# EasyEDA Pro project OSC1.eprj, schematic CH1/2

## Sheets
1 CH1: Create Date: 2024-10-10; Page Name: CH1; Project Name: OSC1; Schematic Name: CH1/2; Update Date: 2024-10-12; Company: 嘉立创EDA; Page Size: A4; Version: V1.0
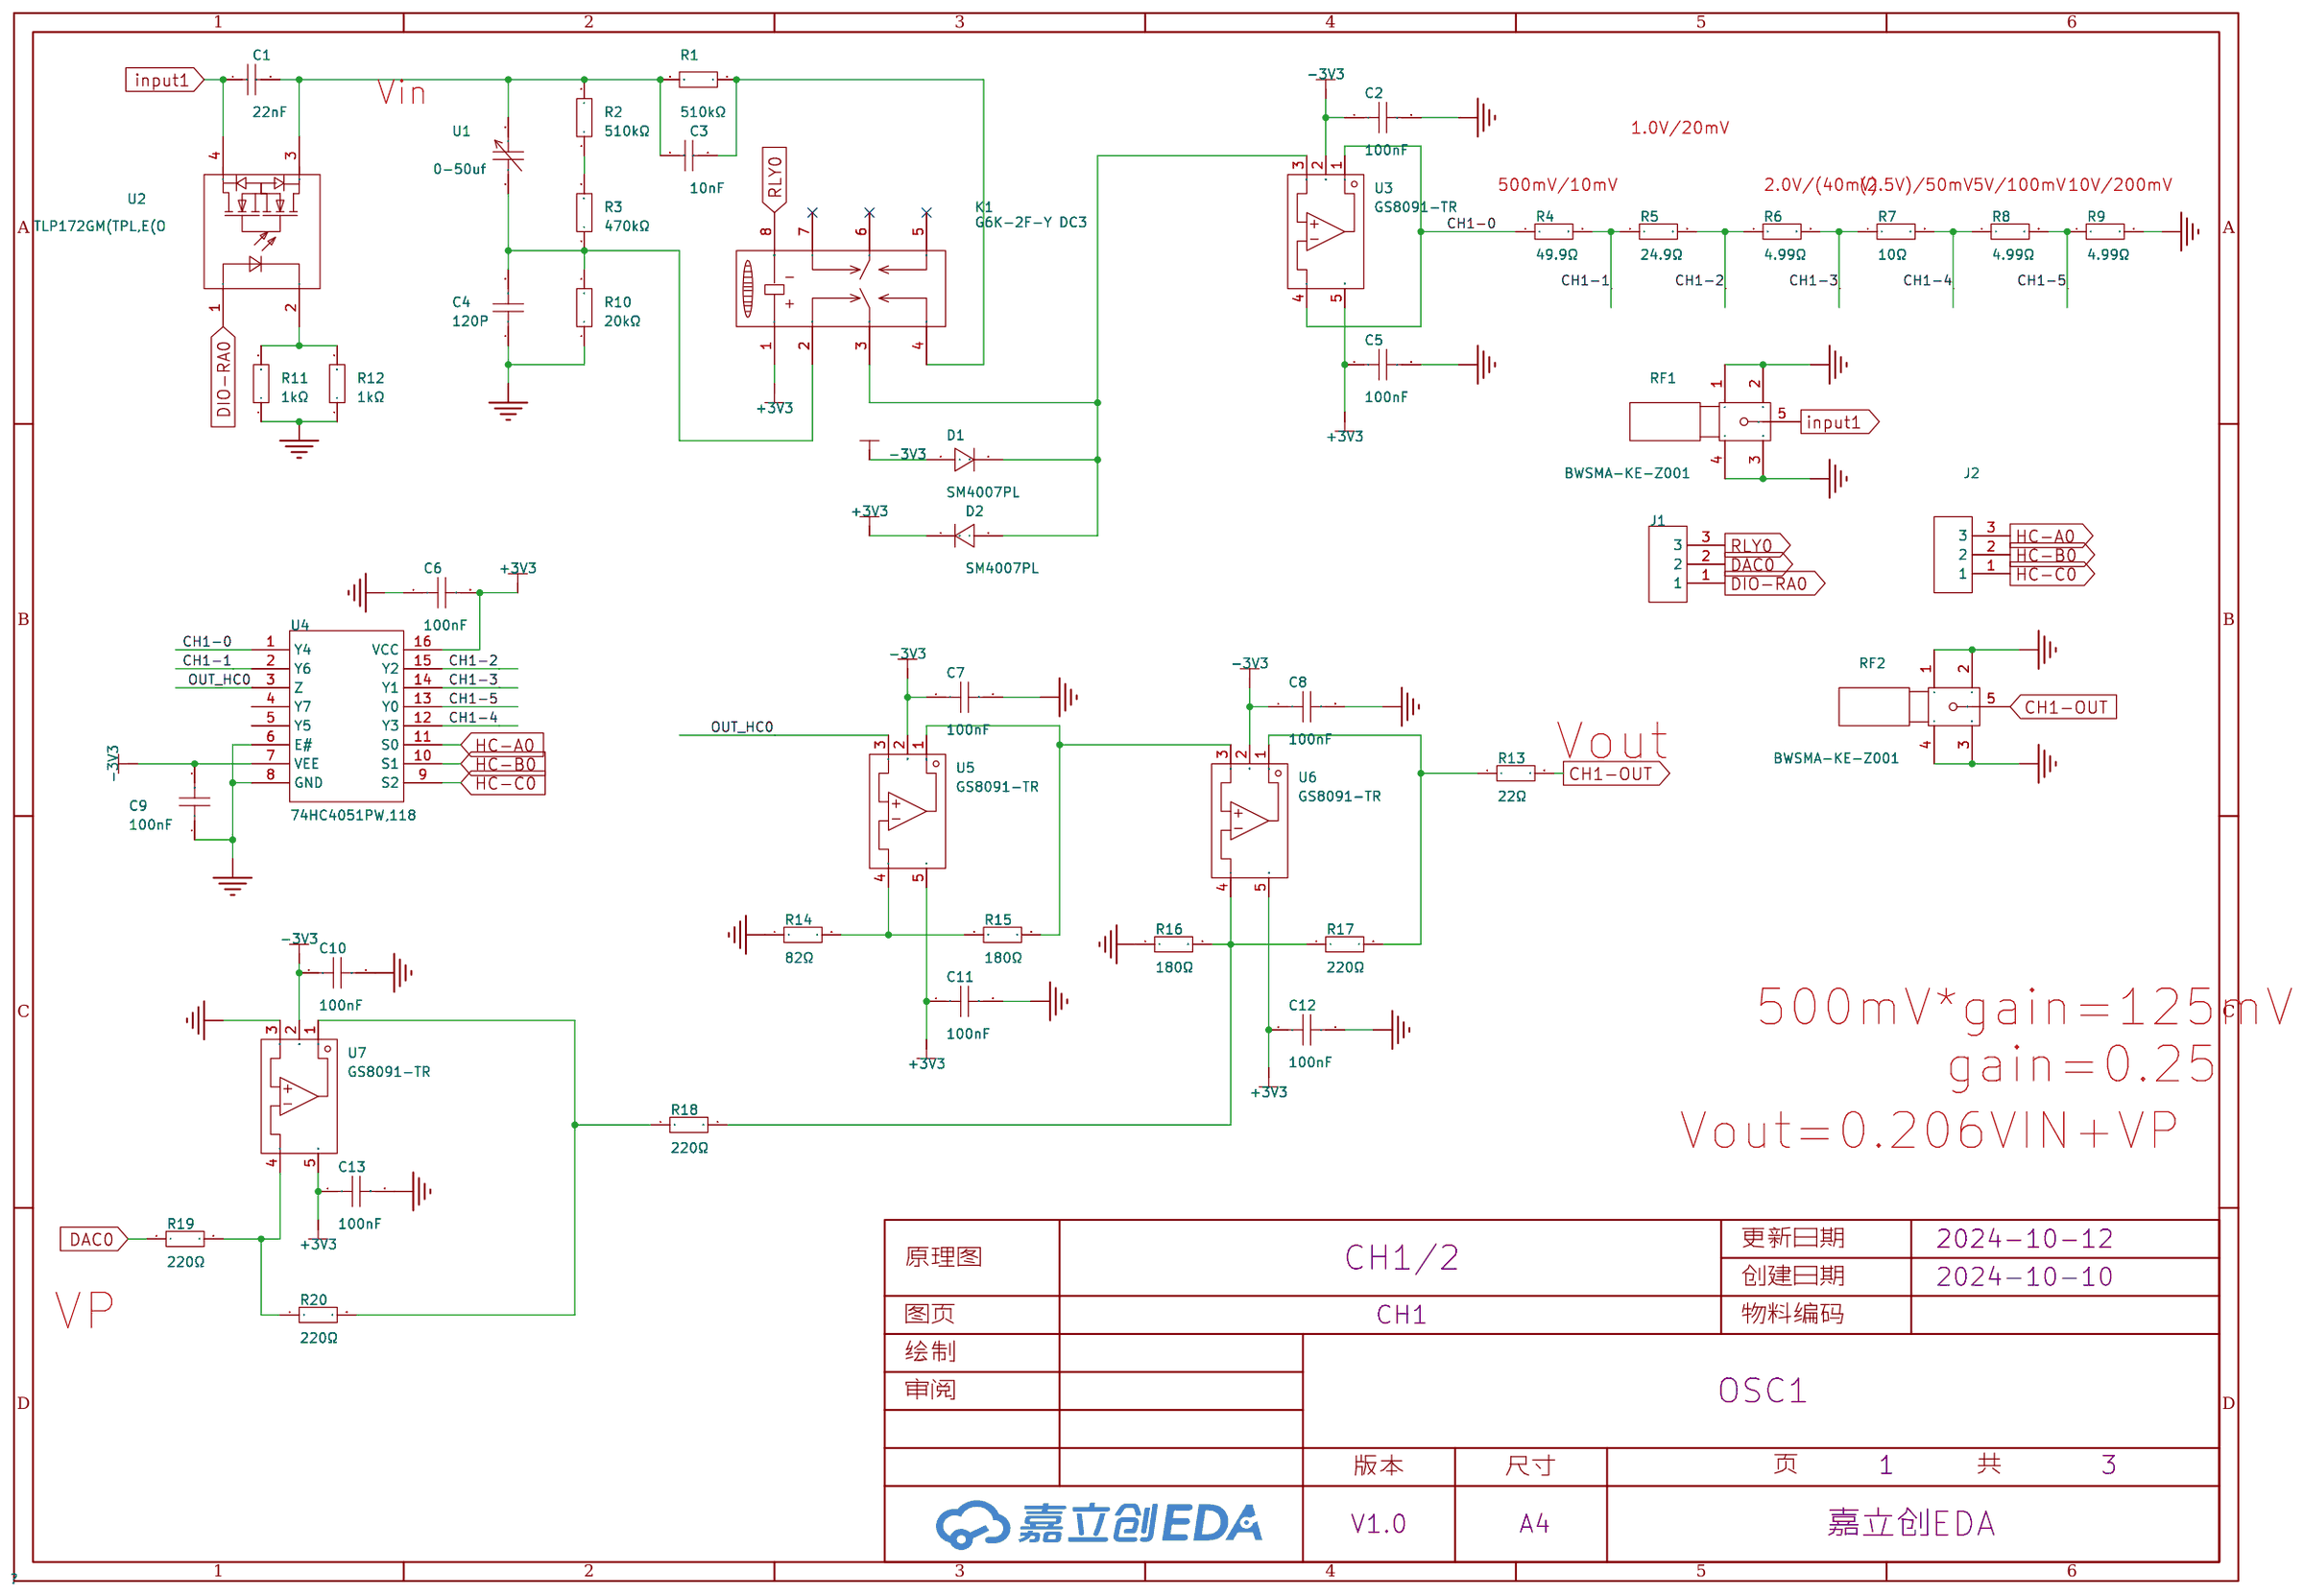
[diagram p1: CH1]
2 CH2: Page Name: CH2
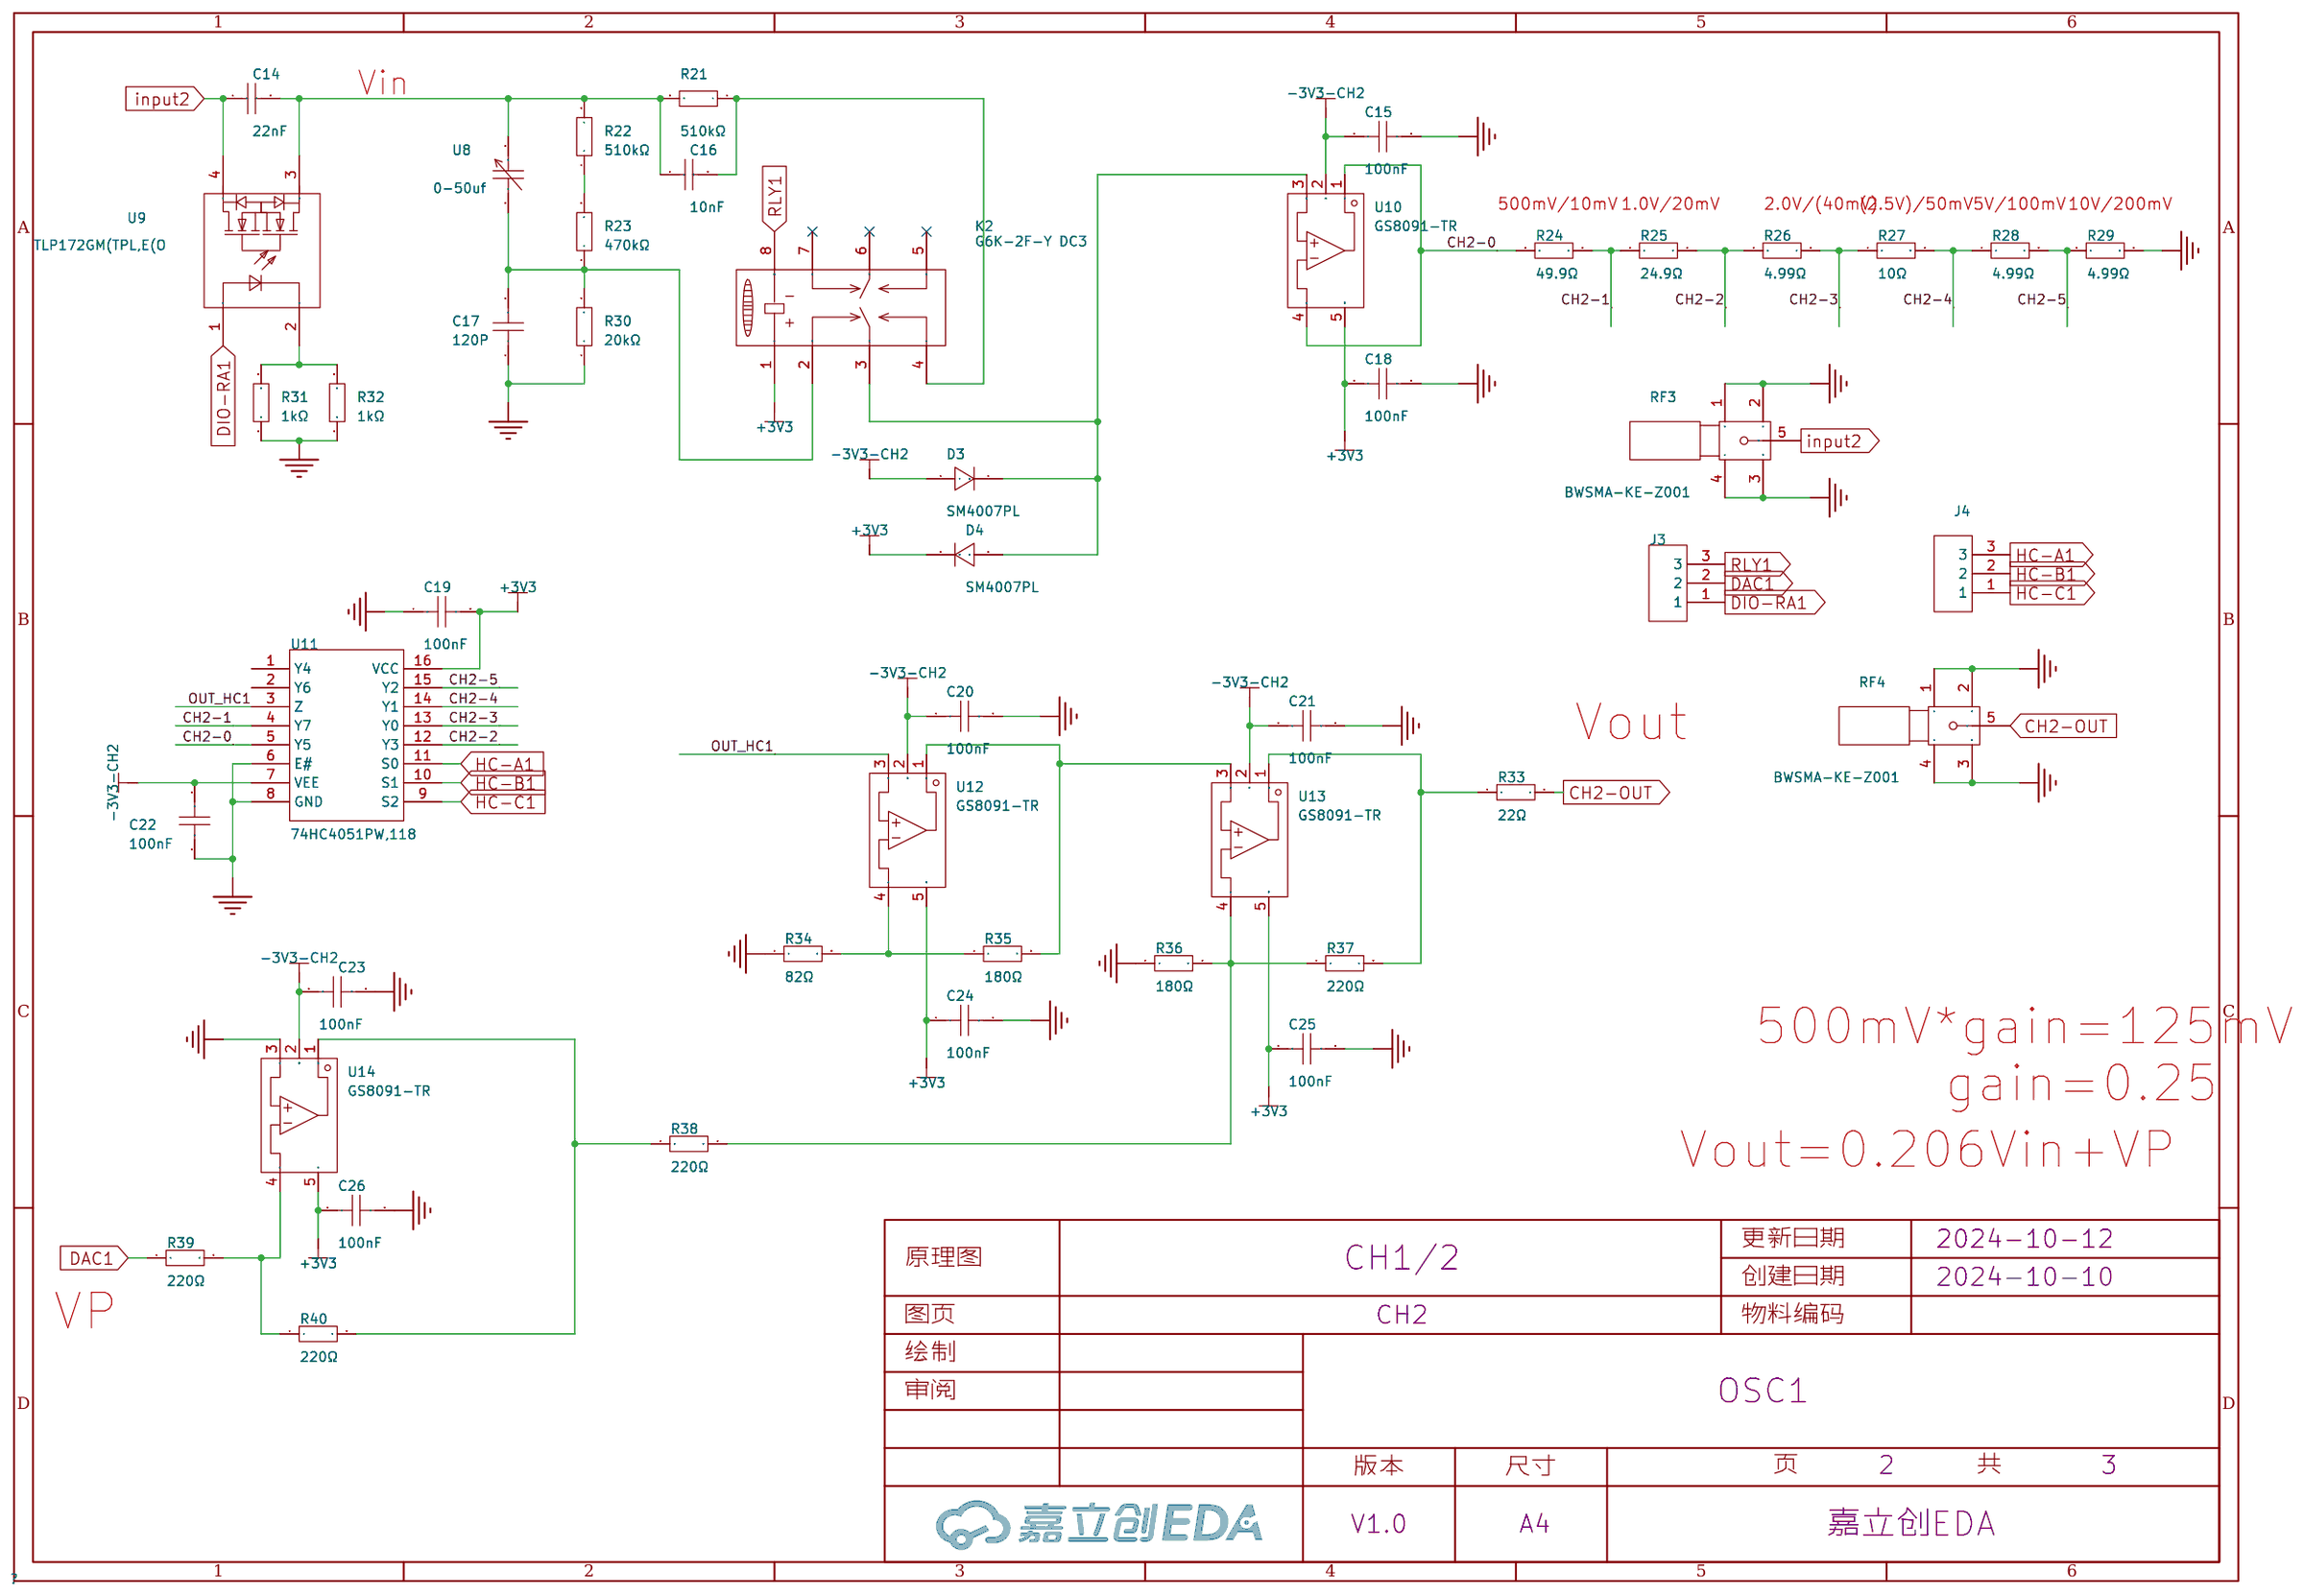
[diagram p2: CH2]
3 电源: Page Name: 电源; Update Date: 2024-10-10
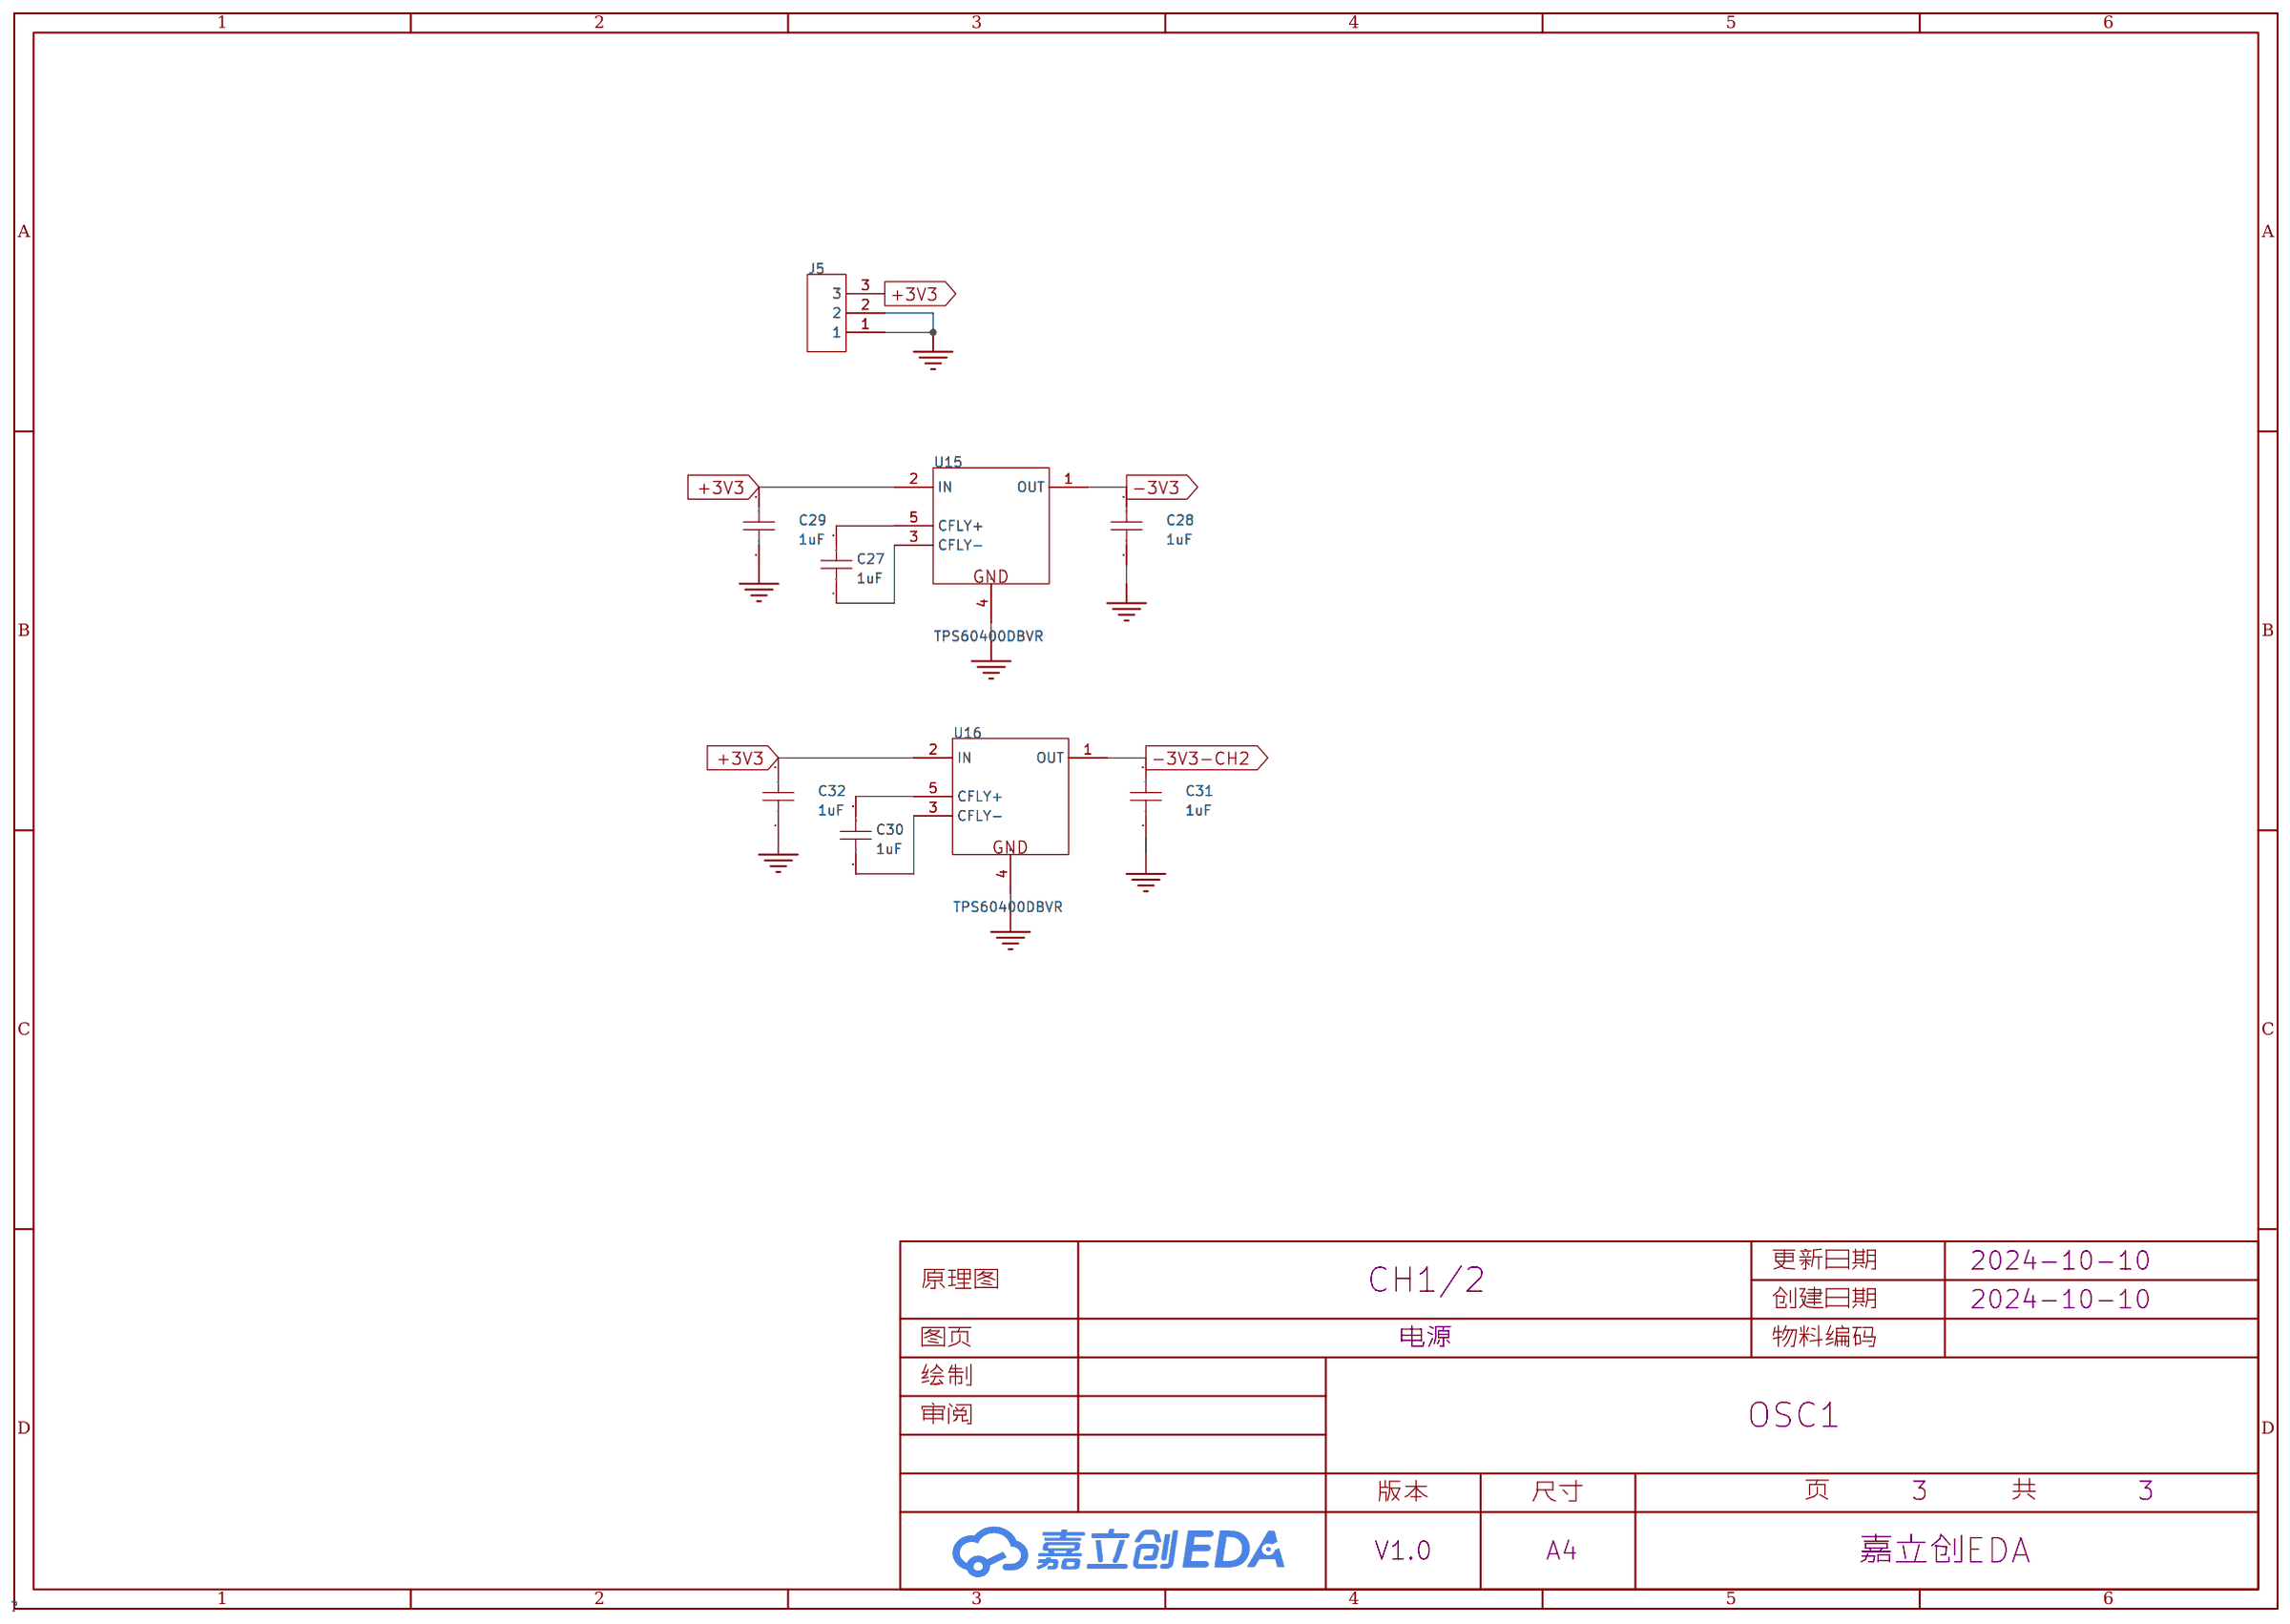
[diagram p3: 电源]

## Parts
sheet CH1
C1  22nF  [C0603]
C2  100nF  [C0402]
C3  10nF  [C0402]
C4  120P  [280*100mil]
C5  100nF  [C0402]
C6  100nF  [C0402]
C7  100nF  [C0402]
C8  100nF  [C0402]
C9  100nF  [C0402]
C10  100nF  [C0402]
C11  100nF  [C0402]
C12  100nF  [C0402]
C13  100nF  [C0402]
D1  SM4007PL  [SOD-123F_L2.8-W1.8-LS3.7-RD]
D2  SM4007PL  [SOD-123F_L2.8-W1.8-LS3.7-RD]
J1  -  [CH2.54-3插座]
J2  -  [CH2.54-3插座]
K1  G6K-2F-Y DC3  [RELAY-SMD_G6K-2F-Y]
R1  510kΩ  [R0402]
R2  510kΩ  [R0402]
R3  470kΩ  [R0402]
R4  49.9Ω  [R0402]
R5  24.9Ω  [R0402]
R6  4.99Ω  [R0402]
R7  10Ω  [R0402]
R8  4.99Ω  [R0402]
R9  4.99Ω  [R0402]
R10  20kΩ  [R0402]
R11  1kΩ  [R0402]
R12  1kΩ  [R0402]
R13  22Ω  [R0402]
R14  82Ω  [R0402]
R15  180Ω  [R0402]
R16  180Ω  [R0402]
R17  220Ω  [R0402]
R18  220Ω  [R0402]
R19  220Ω  [R0402]
R20  220Ω  [R0402]
RF1  BWSMA-KE-Z001  [SMA-TH_BWSMA-KE-Z001]
RF2  BWSMA-KE-Z001  [SMA-TH_BWSMA-KE-Z001]
U1  0-50uf  [可调电容]
U2  TLP172GM(TPL,E(O  [SMD-4_L4.6-W3.7-P2.54-LS7.0-BR]
U3  GS8091-TR  [SOT-23-5_L3.0-W1.7-P0.95-LS2.8-BR]
U4  74HC4051PW,118  [TSSOP-16_L5.0-W4.4-P0.65-LS6.4-BL]
U5  GS8091-TR  [SOT-23-5_L3.0-W1.7-P0.95-LS2.8-BR]
U6  GS8091-TR  [SOT-23-5_L3.0-W1.7-P0.95-LS2.8-BR]
U7  GS8091-TR  [SOT-23-5_L3.0-W1.7-P0.95-LS2.8-BR]
sheet CH2
C14  22nF  [C0603]
C15  100nF  [C0402]
C16  10nF  [C0402]
C17  120P  [280*100mil]
C18  100nF  [C0402]
C19  100nF  [C0402]
C20  100nF  [C0402]
C21  100nF  [C0402]
C22  100nF  [C0402]
C23  100nF  [C0402]
C24  100nF  [C0402]
C25  100nF  [C0402]
C26  100nF  [C0402]
D3  SM4007PL  [SOD-123F_L2.8-W1.8-LS3.7-RD]
D4  SM4007PL  [SOD-123F_L2.8-W1.8-LS3.7-RD]
J3  -  [CH2.54-3插座]
J4  -  [CH2.54-3插座]
K2  G6K-2F-Y DC3  [RELAY-SMD_G6K-2F-Y]
R21  510kΩ  [R0402]
R22  510kΩ  [R0402]
R23  470kΩ  [R0402]
R24  49.9Ω  [R0402]
R25  24.9Ω  [R0402]
R26  4.99Ω  [R0402]
R27  10Ω  [R0402]
R28  4.99Ω  [R0402]
R29  4.99Ω  [R0402]
R30  20kΩ  [R0402]
R31  1kΩ  [R0402]
R32  1kΩ  [R0402]
R33  22Ω  [R0402]
R34  82Ω  [R0402]
R35  180Ω  [R0402]
R36  180Ω  [R0402]
R37  220Ω  [R0402]
R38  220Ω  [R0402]
R39  220Ω  [R0402]
R40  220Ω  [R0402]
RF3  BWSMA-KE-Z001  [SMA-TH_BWSMA-KE-Z001]
RF4  BWSMA-KE-Z001  [SMA-TH_BWSMA-KE-Z001]
U8  0-50uf  [可调电容]
U9  TLP172GM(TPL,E(O  [SMD-4_L4.6-W3.7-P2.54-LS7.0-BR]
U10  GS8091-TR  [SOT-23-5_L3.0-W1.7-P0.95-LS2.8-BR]
U11  74HC4051PW,118  [TSSOP-16_L5.0-W4.4-P0.65-LS6.4-BL]
U12  GS8091-TR  [SOT-23-5_L3.0-W1.7-P0.95-LS2.8-BR]
U13  GS8091-TR  [SOT-23-5_L3.0-W1.7-P0.95-LS2.8-BR]
U14  GS8091-TR  [SOT-23-5_L3.0-W1.7-P0.95-LS2.8-BR]
sheet 电源
C27  1uF  [C0402]
C28  1uF  [C0402]
C29  1uF  [C0402]
C30  1uF  [C0402]
C31  1uF  [C0402]
C32  1uF  [C0402]
J5  -  [CH2.54-3插座]
U15  TPS60400DBVR  [SOT-23-5_L3.0-W1.7-P0.95-LS2.8-BR]
U16  TPS60400DBVR  [SOT-23-5_L3.0-W1.7-P0.95-LS2.8-BR]

## Library data of the parts
C1 C14 = CL10B223KB8NNNC: 容值:22nF;精度:±10%;额定电压:50V;材质(温度系数):X7R;; LCSC Part Name: 22nF ±10% 50V; Supplier Part: C21122; Manufacturer: SAMSUNG(三星); Supplier Footprint: 0603; Datasheet: https://atta.szlcsc.com/upload/public/pdf/source/20160218/1457707763339.pdf; Supplier: LCSC; Tolerance: ±10%; Voltage Rated: 50V; Temperature Coefficient: X7R
C2 C5-C13 C15 C18-C26 = CL05B104KB54PNC: 容值:100nF;精度:±10%;额定电压:50V;材质(温度系数):X7R;; LCSC Part Name: 100nF ±10% 50V; Supplier Part: C307331; Manufacturer: SAMSUNG(三星); Supplier Footprint: 0402; JLCPCB Part Class: 基础库; Datasheet: https://atta.szlcsc.com/upload/public/pdf/source/20160218/1457707763339.pdf; Supplier: LCSC; Tolerance: ±10%; Voltage Rated: 50V; Temperature Coefficient: X7R
C3 C16 = CL05B103KB5NNNC: 容值:10nF;精度:±10%;额定电压:50V;材质(温度系数):X7R;; LCSC Part Name: 10nF ±10% 50V; Supplier Part: C15195; Manufacturer: SAMSUNG(三星); Supplier Footprint: 0402; Datasheet: https://atta.szlcsc.com/upload/public/pdf/source/20160218/1457707763339.pdf; Supplier: LCSC; Tolerance: ±10%; Voltage Rated: 50V; Temperature Coefficient: X7R
C4 C17 = 插件电容
D1-D4 = SM4007PL_C64898: 二极管配置:独立式;正向压降(Vf):1.1V@1A;直流反向耐压(Vr):1kV;整流电流:1A;; LCSC Part Name: 电压:1kV 电流:1A; Supplier Part: C64898; Manufacturer: MDD(辰达半导体); Supplier Footprint: SOD-123FL; Datasheet: https://atta.szlcsc.com/upload/public/pdf/source/20230823/16A8FDE162764C9B685A3717F2DA3690.pdf; Supplier: LCSC; Diode Configuration: 独立式; Forward Voltage (Vf@If): 1.1V@1A; Reverse Voltage (Vr): 1kV; Rectified Current: 1A; Reverse Leakage Current: 10uA@1kV
J1-J5 = HDR-3P
K1 K2 = G6K-2F-Y DC3: 线圈电压:-;触点形式:-;触点容量(电阻负载):-;最大切换电压:-;最大切换电流:-;; LCSC Part Name: G6K-2F-Y 3VDC; Supplier Part: C93168; Manufacturer: OMRON(欧姆龙); Supplier Footprint: SMD,6.5x10mm; JLCPCB Part Class: 扩展库; Datasheet: https://atta.szlcsc.com/upload/public/pdf/source/20220125/C1876770_53E5491D4B68F29C4BBD8118E9BAE0E8.pdf; Supplier: LCSC
R1 R2 R21 R22 = 0402WGF5103TCE: 电阻类型:厚膜电阻;阻值:510kΩ;精度:±1%;功率:62.5mW;最大工作电压:50V;温度系数:±100ppm/℃;; LCSC Part Name: 510kΩ ±1% 62.5mW 厚膜电阻; Supplier Part: C11616; Manufacturer: UNI-ROYAL(厚声); Supplier Footprint: 0402; Datasheet: https://atta.szlcsc.com/upload/public/pdf/source/20200306/C422600_1E6D84923E4A46A82E41ADD87F860B5C.pdf; Supplier: LCSC; Type: 厚膜电阻; Tolerance: ±1%; Power(Watts): 62.5mW; Overload Voltage (Max): 50V; Temperature Coefficient: ±100ppm/℃; Operating Temperature Range: -55℃~+155℃
R3 R23 = 0402WGF4703TCE: 电阻类型:厚膜电阻;阻值:470kΩ;精度:±1%;功率:62.5mW;最大工作电压:50V;温度系数:±100ppm/℃;; LCSC Part Name: 470kΩ ±1% 62.5mW 厚膜电阻; Supplier Part: C25790; Manufacturer: UNI-ROYAL(厚声); Supplier Footprint: 0402; Datasheet: https://atta.szlcsc.com/upload/public/pdf/source/20200306/C422600_1E6D84923E4A46A82E41ADD87F860B5C.pdf; Supplier: LCSC; Type: 厚膜电阻; Tolerance: ±1%; Power(Watts): 62.5mW; Overload Voltage (Max): 50V; Temperature Coefficient: ±100ppm/℃; Operating Temperature Range: -55℃~+155℃
R4 R24 = 0402WGF499JTCE: 电阻类型:厚膜电阻;阻值:49.9Ω;精度:±1%;功率:62.5mW;最大工作电压:50V;温度系数:±100ppm/℃;; LCSC Part Name: 49.9Ω ±1% 62.5mW 厚膜电阻; Supplier Part: C25120; Manufacturer: UNI-ROYAL(厚声); Supplier Footprint: 0402; JLCPCB Part Class: 基础库; Datasheet: https://atta.szlcsc.com/upload/public/pdf/source/20200306/C422600_1E6D84923E4A46A82E41ADD87F860B5C.pdf; Supplier: LCSC; Type: 厚膜电阻; Tolerance: ±1%; Power(Watts): 62.5mW; Overload Voltage (Max): 50V; Temperature Coefficient: ±100ppm/℃; Operating Temperature Range: -55℃~+155℃
R5 R25 = 0402WGF249JTCE: 电阻类型:厚膜电阻;阻值:24.9Ω;精度:±1%;功率:62.5mW;最大工作电压:50V;温度系数:±200ppm/℃;; LCSC Part Name: 24.9Ω ±1% 62.5mW 厚膜电阻; Supplier Part: C5099; Manufacturer: UNI-ROYAL(厚声); Supplier Footprint: 0402; JLCPCB Part Class: 扩展库; Datasheet: https://atta.szlcsc.com/upload/public/pdf/source/20200306/C422600_1E6D84923E4A46A82E41ADD87F860B5C.pdf; Supplier: LCSC; Type: 厚膜电阻; Tolerance: ±1%; Power(Watts): 62.5mW; Overload Voltage (Max): 50V; Temperature Coefficient: ±200ppm/℃; Operating Temperature Range: -55℃~+155℃
R6 R8 R9 R26 R28 R29 = 0402WGF499KTCE: 电阻类型:厚膜电阻;阻值:4.99Ω;精度:±1%;功率:62.5mW;最大工作电压:50V;温度系数:±400ppm/℃;; LCSC Part Name: 4.99Ω ±1% 62.5mW 厚膜电阻; Supplier Part: C25122; Manufacturer: UNI-ROYAL(厚声); Supplier Footprint: 0402; JLCPCB Part Class: 扩展库; Datasheet: https://atta.szlcsc.com/upload/public/pdf/source/20200306/C422600_1E6D84923E4A46A82E41ADD87F860B5C.pdf; Supplier: LCSC; Type: 厚膜电阻; Tolerance: ±1%; Power(Watts): 62.5mW; Overload Voltage (Max): 50V; Temperature Coefficient: ±400ppm/℃; Operating Temperature Range: -55℃~+155℃
R7 R27 = 0402WGF100JTCE: 电阻类型:厚膜电阻;阻值:10Ω;精度:±1%;功率:62.5mW;最大工作电压:50V;温度系数:±200ppm/℃;; LCSC Part Name: 10Ω ±1% 62.5mW 厚膜电阻; Supplier Part: C25077; Manufacturer: UNI-ROYAL(厚声); Supplier Footprint: 0402; Datasheet: https://atta.szlcsc.com/upload/public/pdf/source/20200306/C422600_1E6D84923E4A46A82E41ADD87F860B5C.pdf; Supplier: LCSC; Type: 厚膜电阻; Tolerance: ±1%; Power(Watts): 62.5mW; Overload Voltage (Max): 50V; Temperature Coefficient: ±200ppm/℃; Operating Temperature Range: -55℃~+155℃
R10 R30 = 0402WGF2002TCE: 电阻类型:厚膜电阻;阻值:20kΩ;精度:±1%;功率:62.5mW;最大工作电压:50V;温度系数:±100ppm/℃;; LCSC Part Name: 20kΩ ±1% 62.5mW 厚膜电阻; Supplier Part: C25765; Manufacturer: UNI-ROYAL(厚声); Supplier Footprint: 0402; Datasheet: https://atta.szlcsc.com/upload/public/pdf/source/20200306/C422600_1E6D84923E4A46A82E41ADD87F860B5C.pdf; Supplier: LCSC; Type: 厚膜电阻; Tolerance: ±1%; Power(Watts): 62.5mW; Overload Voltage (Max): 50V; Temperature Coefficient: ±100ppm/℃; Operating Temperature Range: -55℃~+155℃
R11 R12 R31 R32 = 0402WGF1001TCE: 电阻类型:厚膜电阻;阻值:1kΩ;精度:±1%;功率:62.5mW;最大工作电压:50V;温度系数:±100ppm/℃;; LCSC Part Name: 1kΩ ±1% 62.5mW 厚膜电阻; Supplier Part: C11702; Manufacturer: UNI-ROYAL(厚声); Supplier Footprint: 0402; Datasheet: https://atta.szlcsc.com/upload/public/pdf/source/20200306/C422600_1E6D84923E4A46A82E41ADD87F860B5C.pdf; Supplier: LCSC; Type: 厚膜电阻; Tolerance: ±1%; Power(Watts): 62.5mW; Overload Voltage (Max): 50V; Temperature Coefficient: ±100ppm/℃; Operating Temperature Range: -55℃~+155℃
R13 R33 = 0402WGF220JTCE: 电阻类型:厚膜电阻;阻值:22Ω;精度:±1%;功率:62.5mW;最大工作电压:50V;温度系数:±100ppm/℃;; LCSC Part Name: 22Ω ±1% 62.5mW 厚膜电阻; Supplier Part: C25092; Manufacturer: UNI-ROYAL(厚声); Supplier Footprint: 0402; JLCPCB Part Class: 基础库; Datasheet: https://atta.szlcsc.com/upload/public/pdf/source/20200306/C422600_1E6D84923E4A46A82E41ADD87F860B5C.pdf; Supplier: LCSC; Type: 厚膜电阻; Tolerance: ±1%; Power(Watts): 62.5mW; Overload Voltage (Max): 50V; Temperature Coefficient: ±100ppm/℃; Operating Temperature Range: -55℃~+155℃
R14 R34 = 0402WGF820JTCE: 电阻类型:厚膜电阻;阻值:82Ω;精度:±1%;功率:62.5mW;最大工作电压:50V;温度系数:±200ppm/℃;; LCSC Part Name: 82Ω ±1% 62.5mW 厚膜电阻; Supplier Part: C25136; Manufacturer: UNI-ROYAL(厚声); Supplier Footprint: 0402; JLCPCB Part Class: 扩展库; Datasheet: https://atta.szlcsc.com/upload/public/pdf/source/20200306/C422600_1E6D84923E4A46A82E41ADD87F860B5C.pdf; Supplier: LCSC; Type: 厚膜电阻; Tolerance: ±1%; Power(Watts): 62.5mW; Overload Voltage (Max): 50V; Temperature Coefficient: ±200ppm/℃; Operating Temperature Range: -55℃~+155℃
R15 R16 R35 R36 = 0402WGF1800TCE: 电阻类型:厚膜电阻;阻值:180Ω;精度:±1%;功率:62.5mW;最大工作电压:50V;温度系数:±100ppm/℃;; LCSC Part Name: 180Ω ±1% 62.5mW 厚膜电阻; Supplier Part: C38941; Manufacturer: UNI-ROYAL(厚声); Supplier Footprint: 0402; JLCPCB Part Class: 扩展库; Datasheet: https://atta.szlcsc.com/upload/public/pdf/source/20200306/C422600_1E6D84923E4A46A82E41ADD87F860B5C.pdf; Supplier: LCSC; Type: 厚膜电阻; Tolerance: ±1%; Power(Watts): 62.5mW; Overload Voltage (Max): 50V; Temperature Coefficient: ±100ppm/℃; Operating Temperature Range: -55℃~+155℃
R17-R20 R37-R40 = 0402WGF2200TCE: 电阻类型:厚膜电阻;阻值:220Ω;精度:±1%;功率:62.5mW;最大工作电压:50V;温度系数:±100ppm/℃;; LCSC Part Name: 220Ω ±1% 62.5mW 厚膜电阻; Supplier Part: C25091; Manufacturer: UNI-ROYAL(厚声); Supplier Footprint: 0402; JLCPCB Part Class: 基础库; Datasheet: https://atta.szlcsc.com/upload/public/pdf/source/20200306/C422600_1E6D84923E4A46A82E41ADD87F860B5C.pdf; Supplier: LCSC; Type: 厚膜电阻; Tolerance: ±1%; Power(Watts): 62.5mW; Overload Voltage (Max): 50V; Temperature Coefficient: ±100ppm/℃; Operating Temperature Range: -55℃~+155℃
RF1-RF4 = BWSMA-KE-Z001_C496549: 连接器类型:板端;接口类型:内孔;端口数量:1;接口直径:-;接口长度/高度:-;频率-最大值:-;射频系列:SMA;阻抗:50Ω;样式:正脚;触头材质:-;触头镀层:-;工作温度范围:-65℃~+165℃;焊接温度(最大值):-;; LCSC Part Name: 内孔 SMA 正脚; Supplier Part: C496549; Manufacturer: BAT WIRELESS(蝙蝠无线); Supplier Footprint: 插件; Datasheet: https://atta.szlcsc.com/upload/public/pdf/source/20221228/40BF41E56A06003A0210E1785CA66EA6.pdf; Supplier: LCSC; Connector Type: 板端; Interface Type: 内孔; Number of Ports: 1; RF Series: SMA; Impedance: 50Ω; Style: 正脚; Operating Temperature Range: -65℃~+165℃
U1 U8 = 0-50uf可调电容
U2 U9 = TLP172GM(TPL,E(O: 继电器触点形式:1 Form A(SPST-NO);适用负载类型:AC,DC;正向压降:1.27V;负载电压:350V;连续负载电流:110mA;导通电阻:22Ω;; LCSC Part Name: 1 Form A(SPSTNO) 负载AC,DC 负载电压350V; Supplier Part: C261926; Manufacturer: TOSHIBA(东芝); Supplier Footprint: SOP-4-2.54mm; Datasheet: https://atta.szlcsc.com/upload/public/pdf/source/20180801/C261926_98E6F8A0917C7E31AE8EC16F9B9F81C3.pdf; Supplier: LCSC; Relay Contact Form: 1 Form A(SPST-NO); Load Type: AC,DC; Input Forward Voltage: 1.27V; Voltage - Load: 350V; Continuous Load Current: 110mA; On Resistance: 22Ω; Isolation Voltage(rms): 3.75kV; Turn-on time: 500us; Turn-off time: 100us
U3 U5-U7 U10 U12-U14 = GS8091-TR: 放大器数:单路;增益带宽积(GBP):180MHz;输入偏置电流(Ib):1pA;输入失调电压(Vos):2mV;压摆率(SR):206V/us;带宽(-3db):350MHz;; LCSC Part Name: GS8091 SOT-23-5; Supplier Part: C157724; Manufacturer: Gainsil(聚洵); Supplier Footprint: SOT-23-5; JLCPCB Part Class: 扩展库; Datasheet: https://atta.szlcsc.com/upload/public/pdf/source/20220610/E3748DDE2830B859623FB1BDA24ABCCF.pdf; Supplier: LCSC; Number of Circuits: 单路; Gain Bandwidth Product(GBP): 180MHz; Current - Input Bias(Ib): 1pA; Voltage - Input Offset(Vos): 2mV; Slew Rate(SR): 206V/us; Supply Voltage: -；-；-; -3db Bandwidth: 350MHz; Supply Current: 4.2mA
U4 U11 = 74HC4051PW,118: 通道数:1;导通电阻(Ron@VCC):120Ω;; Supplier Part: C5645; Manufacturer: Nexperia(安世); Supplier Footprint: TSSOP-16; JLCPCB Part Class: 扩展库; Datasheet: https://atta.szlcsc.com/upload/public/pdf/source/20120413/1457706470089.pdf; Supplier: LCSC; Number of Channels: 1; Supply Voltage: 2V~10V; Turn-on time: 51ns; On-State Resistance (Max): 120Ω; Turn-off time: 42ns
C27-C32 = CL05A105KA5NQNC: 容值:1uF;精度:±10%;额定电压:25V;材质(温度系数):X5R;; LCSC Part Name: 1uF ±10% 25V; Supplier Part: C52923; Manufacturer: SAMSUNG(三星); Supplier Footprint: 0402; JLCPCB Part Class: 基础库; Datasheet: https://atta.szlcsc.com/upload/public/pdf/source/20160218/1457707763339.pdf; Supplier: LCSC; Tolerance: ±10%; Voltage Rated: 25V; Temperature Coefficient: X5R
U15 U16 = TPS60400DBVR: TPS60400 具有可变开关频率的 60mA 电荷泵电压逆变器; Supplier Part: C9839; Manufacturer: TI(德州仪器); Supplier Footprint: SOT-23-5; JLCPCB Part Class: 扩展库; Datasheet: https://www.ti.com/cn/lit/gpn/tps60400; Supplier: LCSC

## Nets
+3V3: C5.1 C6.2 C11.1 C12.1 C13.1 C18.1 C19.2 C24.1 C25.1 C26.1 C29.2 C32.2 D2.1(C) D4.1(C) J5.3 K1.1 K2.1 U3.5(VDD) U4.16(VCC) U5.5(VDD) U6.5(VDD) U7.5(VDD) U10.5(VDD) U11.16(VCC) U12.5(VDD) U13.5(VDD) U14.5(VDD) U15.2(IN) U16.2(IN)
-3V3: C2.1 C7.1 C8.1 C9.2 C10.1 C28.2 D1.2(A) U3.2(VSS) U4.7(VEE) U5.2(VSS) U6.2(VSS) U7.2(VSS) U15.1(OUT)
-3V3-CH2: C15.1 C20.1 C21.1 C22.2 C23.1 C31.2 D3.2(A) U10.2(VSS) U11.7(VEE) U12.2(VSS) U13.2(VSS) U14.2(VSS) U16.1(OUT)
GND: C2.2 C4.1 C5.2 C6.1 C7.2 C8.2 C9.1 C10.2 C11.2 C12.2 C13.2 C15.2 C17.1 C18.2 C19.1 C20.2 C21.2 C22.1 C23.2 C24.2 C25.2 C26.2 C28.1 C29.1 C31.1 C32.1 J5.1 J5.2 R9.2 R10.1 R11.1 R12.1 R14.1 R16.1 R29.2 R30.1 R31.1 R32.1 R34.1 R36.1 RF1.1 RF1.2 RF1.3 RF1.4 RF2.1 RF2.2 RF2.3 RF2.4 RF3.1 RF3.2 RF3.3 RF3.4 RF4.1 RF4.2 RF4.3 RF4.4 U4.6(E#) U4.8(GND) U7.3(IN+) U11.6(E#) U11.8(GND) U14.3(IN+) U15.4(GND) U16.4(GND)
CH1-0: R4.1 U3.1(OUT) U3.4(IN-) U4.1(Y4)
CH1-1: R4.2 R5.1 U4.2(Y6)
CH1-2: R5.2 R6.1 U4.15(Y2)
CH1-3: R6.2 R7.1 U4.14(Y1)
CH1-4: R7.2 R8.1 U4.12(Y3)
CH1-5: R8.2 R9.1 U4.13(Y0)
CH1-OUT: R13.2 RF2.5
CH2-0: R24.1 U10.1(OUT) U10.4(IN-) U11.5(Y5)
CH2-1: R24.2 R25.1 U11.4(Y7)
CH2-2: R25.2 R26.1 U11.12(Y3)
CH2-3: R26.2 R27.1 U11.13(Y0)
CH2-4: R27.2 R28.1 U11.14(Y1)
CH2-5: R28.2 R29.1 U11.15(Y2)
CH2-OUT: R33.2 RF4.5
DAC0: J1.2 R19.1
DAC1: J3.2 R39.1
DIO-RA0: J1.1 U2.1
DIO-RA1: J3.1 U9.1
HC-A0: J2.3 U4.11(S0)
HC-A1: J4.3 U11.11(S0)
HC-B0: J2.2 U4.10(S1)
HC-B1: J4.2 U11.10(S1)
HC-C0: J2.1 U4.9(S2)
HC-C1: J4.1 U11.9(S2)
input1: C1.1 RF1.5 U2.4
input2: C14.1 RF3.5 U9.4
OUT_HC0: U4.3(Z) U5.3(IN+)
OUT_HC1: U11.3(Z) U12.3(IN+)
RLY0: J1.3 K1.8
RLY1: J3.3 K2.8
$1N1760: R11.2 R12.2 U2.2
$1N2407: C4.2 K1.2 R3.1 R10.2 U1.1
$1N11061: D1.1(C) D2.2(A) K1.3 U3.3(IN+)
$1N11884: R15.2 U5.1(OUT) U6.3(IN+)
$1N12026: R13.1 R17.2 U6.1(OUT)
$1N12901: R14.2 R15.1 U5.4(IN-)
$1N12908: R16.2 R17.1 R18.2 U6.4(IN-)
$1N20167: C1.2 C3.1 R1.2 R2.2 U1.2 U2.3
$1N20346: R2.1 R3.2
$1N20539: C3.2 K1.4 R1.1
$1N22217: R19.2 R20.1 U7.4(IN-)
$1N22283: R18.1 R20.2 U7.1(OUT)
$6N4438: R31.2 R32.2 U9.2
$6N4445: C17.2 K2.2 R23.1 R30.2 U8.1
$6N4470: D3.1(C) D4.2(A) K2.3 U10.3(IN+)
$6N4490: R35.2 U12.1(OUT) U13.3(IN+)
$6N4491: R33.1 R37.2 U13.1(OUT)
$6N4495: R34.2 R35.1 U12.4(IN-)
$6N4496: R36.2 R37.1 R38.2 U13.4(IN-)
$6N4497: C14.2 C16.1 R21.2 R22.2 U8.2 U9.3
$6N4505: R22.1 R23.2
$6N4507: C16.2 K2.4 R21.1
$6N4545: R39.2 R40.1 U14.4(IN-)
$6N4553: R38.1 R40.2 U14.1(OUT)
$7N308: C27.2 U15.5(CFLY+)
$7N311: C27.1 U15.3(CFLY-)
$7N1156: C30.2 U16.5(CFLY+)
$7N1157: C30.1 U16.3(CFLY-)

Not connected (* = marked no-connect by the designer): K1 5* 6* 7*; K2 5* 6* 7*; U4 4(Y7) 5(Y5); U11 1(Y4) 2(Y6)

## Notes on the sheets
sheet 1
- Vin
- 1.0V/20mV
- 500mV/10mV
- 2.0V/(40mV)
- (2.5V)/50mV
- 5V/100mV
- 10V/200mV
- Vout
- 500mV*gain=125mV
- gain=0.25
- Vout=0.206VIN+VP
- VP
sheet 2
- Vin
- 500mV/10mV
- 1.0V/20mV
- 2.0V/(40mV)
- (2.5V)/50mV
- 5V/100mV
- 10V/200mV
- Vout
- 500mV*gain=125mV
- gain=0.25
- Vout=0.206Vin+VP
- VP
